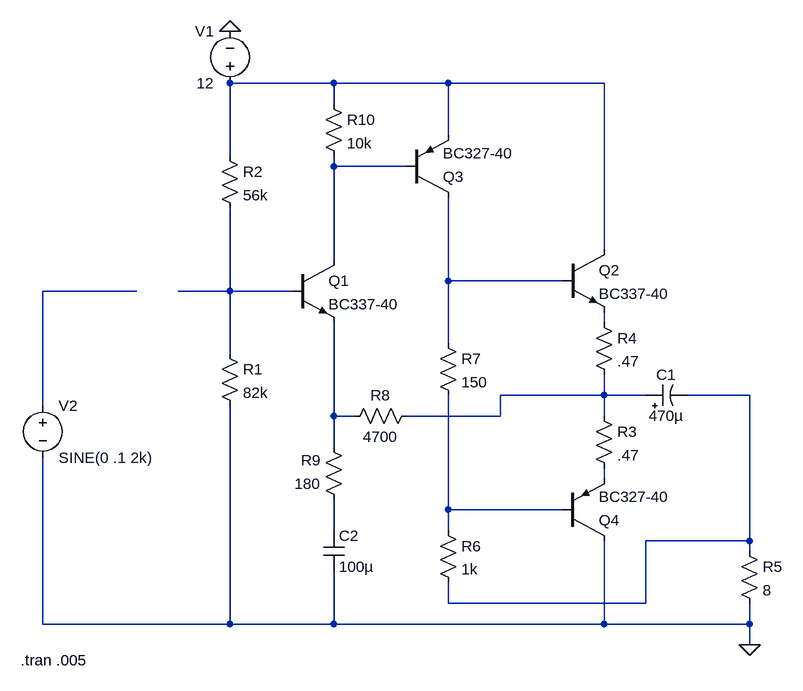
[diagram p0: schematic Problema 7 TP2.asc]
Problema 7 TP2.asc, the LTspice schematic file:
Version 4
SHEET 1 996 680
WIRE 304 -256 144 -256
WIRE 480 -256 304 -256
WIRE 720 -256 480 -256
WIRE 304 -224 304 -256
WIRE 480 -176 480 -256
WIRE 144 -144 144 -256
WIRE 304 -128 304 -144
WIRE 416 -128 304 -128
WIRE 720 0 720 -256
WIRE 304 16 304 -128
WIRE 480 48 480 -80
WIRE 656 48 480 48
WIRE 0 64 -144 64
WIRE 144 64 144 -64
WIRE 144 64 64 64
WIRE 240 64 144 64
WIRE 720 112 720 96
WIRE 480 144 480 48
WIRE 144 160 144 64
WIRE 720 224 720 192
WIRE 720 224 560 224
WIRE 784 224 720 224
WIRE 944 224 848 224
WIRE -144 240 -144 64
WIRE 304 256 304 112
WIRE 336 256 304 256
WIRE 560 256 560 224
WIRE 560 256 416 256
WIRE 720 256 720 224
WIRE 304 304 304 256
WIRE 720 352 720 336
WIRE 480 400 480 224
WIRE 656 400 480 400
WIRE 304 432 304 384
WIRE 480 432 480 400
WIRE 944 448 944 224
WIRE 944 448 784 448
WIRE 944 464 944 448
WIRE 480 544 480 512
WIRE 784 544 784 448
WIRE 784 544 480 544
WIRE -144 576 -144 320
WIRE 144 576 144 240
WIRE 144 576 -144 576
WIRE 304 576 304 496
WIRE 304 576 144 576
WIRE 720 576 720 448
WIRE 720 576 304 576
WIRE 944 576 944 544
WIRE 944 576 720 576
WIRE 944 608 944 576
FLAG 944 608 0
FLAG 144 -336 0
SYMBOL res 128 144 R0
SYMATTR InstName R1
SYMATTR Value 82k
SYMBOL res 128 -160 R0
SYMATTR InstName R2
SYMATTR Value 56k
SYMBOL npn 240 16 R0
SYMATTR InstName Q1
SYMATTR Value BC337-40
SYMBOL npn 656 0 R0
SYMATTR InstName Q2
SYMATTR Value BC337-40
SYMBOL pnp 416 -80 M180
SYMATTR InstName Q3
SYMATTR Value BC327-40
SYMBOL pnp 656 448 M180
SYMATTR InstName Q4
SYMATTR Value BC327-40
SYMBOL res 704 240 R0
SYMATTR InstName R3
SYMATTR Value .47
SYMBOL res 704 96 R0
SYMATTR InstName R4
SYMATTR Value .47
SYMBOL polcap 784 240 R270
WINDOW 0 32 32 VTop 2
WINDOW 3 0 32 VBottom 2
SYMATTR InstName C1
SYMATTR Value 470µ
SYMATTR Description Capacitor
SYMATTR Type cap
SYMATTR SpiceLine V=25 Irms=985m Rser=0.07 Lser=0 mfg="Nichicon" pn="UPL1E471MRH6" type="Al electrolytic"
SYMBOL res 928 448 R0
SYMATTR InstName R5
SYMATTR Value 8
SYMBOL res 464 416 R0
SYMATTR InstName R6
SYMATTR Value 1k
SYMBOL res 464 128 R0
SYMATTR InstName R7
SYMATTR Value 150
SYMBOL res 432 240 R90
WINDOW 0 0 56 VBottom 2
WINDOW 3 32 56 VTop 2
SYMATTR InstName R8
SYMATTR Value 4700
SYMBOL res 320 400 R180
WINDOW 0 36 76 Left 2
WINDOW 3 36 40 Left 2
SYMATTR InstName R9
SYMATTR Value 180
SYMBOL cap 288 432 R0
SYMATTR InstName C2
SYMATTR Value 100µ
SYMBOL res 288 -240 R0
SYMATTR InstName R10
SYMATTR Value 10k
SYMBOL voltage 144 -240 R180
WINDOW 0 24 96 Left 2
WINDOW 3 24 16 Left 2
SYMATTR InstName V1
SYMATTR Value 12
SYMBOL voltage -144 224 R0
WINDOW 123 0 0 Left 0
WINDOW 39 0 0 Left 0
SYMATTR InstName V2
SYMATTR Value SINE(0 .1 2k)
TEXT -178 632 Left 2 !.tran .005

The netlist it stands for:
* Problema 7 TP2.asc
R1 N005 0 82k
R2 N001 N005 56k
Q1 N002 N005 N009 0 BC337-40
Q2 N001 N003 N006 0 BC337-40
Q3 N003 N002 N001 0 BC327-40
Q4 0 N011 N010 0 BC327-40
R3 N007 N010 .47
R4 N006 N007 .47
C1 N007 N008 470µ V=25 Irms=985m Rser=0.07 Lser=0 mfg="Nichicon" pn="UPL1E471MRH6" type="Al electrolytic"
R5 N008 0 8
R6 N011 N008 1k
R7 N003 N011 150
R8 N007 N009 4700
R9 N012 N009 180
C2 N012 0 100µ
R10 N001 N002 10k
V1 N001 0 12
V2 N004 0 SINE(0 .1 2k)
.model NPN NPN
.model PNP PNP
.lib standard.bjt
.tran .005
.backanno
.end